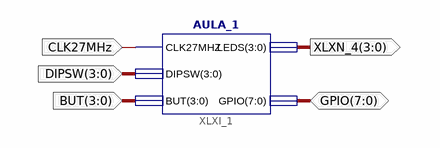
[diagram p0: schematic sheet 1]
// Xilinx ISE schematic Aula_sim.sch (spartan6) as structural Verilog: 1 symbols, 5 ports
module Aula_sim (
  input  [3:0] DIPSW,
  input  CLK27MHz,
  input  [3:0] BUT,
  inout  [7:0] GPIO,
  output [3:0] XLXN_4
);

  AULA_1 XLXI_1 (.CLK27MHZ(CLK27MHz), .DIPSW(DIPSW), .BUT(BUT), .LEDS(XLXN_4), .GPIO(GPIO));
endmodule
